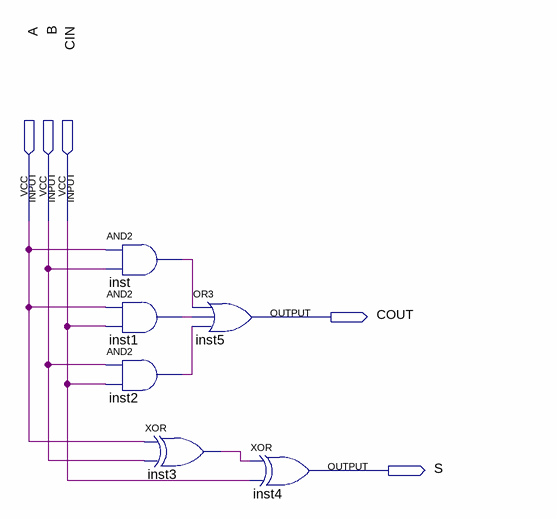
[diagram p0: schematic sheet]
// Quartus schematic fulladder1.bdf as structural Verilog: 6 symbols, 5 pins
module fulladder1 (
  input  A,
  input  B,
  input  CIN,
  output COUT,
  output S
);

  wire inst1_out, inst2_out, inst3_out, inst_out;

  and inst (inst_out, A, B);
  and inst1 (inst1_out, A, CIN);
  and inst2 (inst2_out, B, CIN);
  xor inst3 (inst3_out, A, B);
  or inst5 (COUT, inst_out, inst1_out, inst2_out);
  xor inst4 (S, inst3_out, CIN);
endmodule
